# EAGLE design relayboard-v1 (EAGLE 9.6.2)
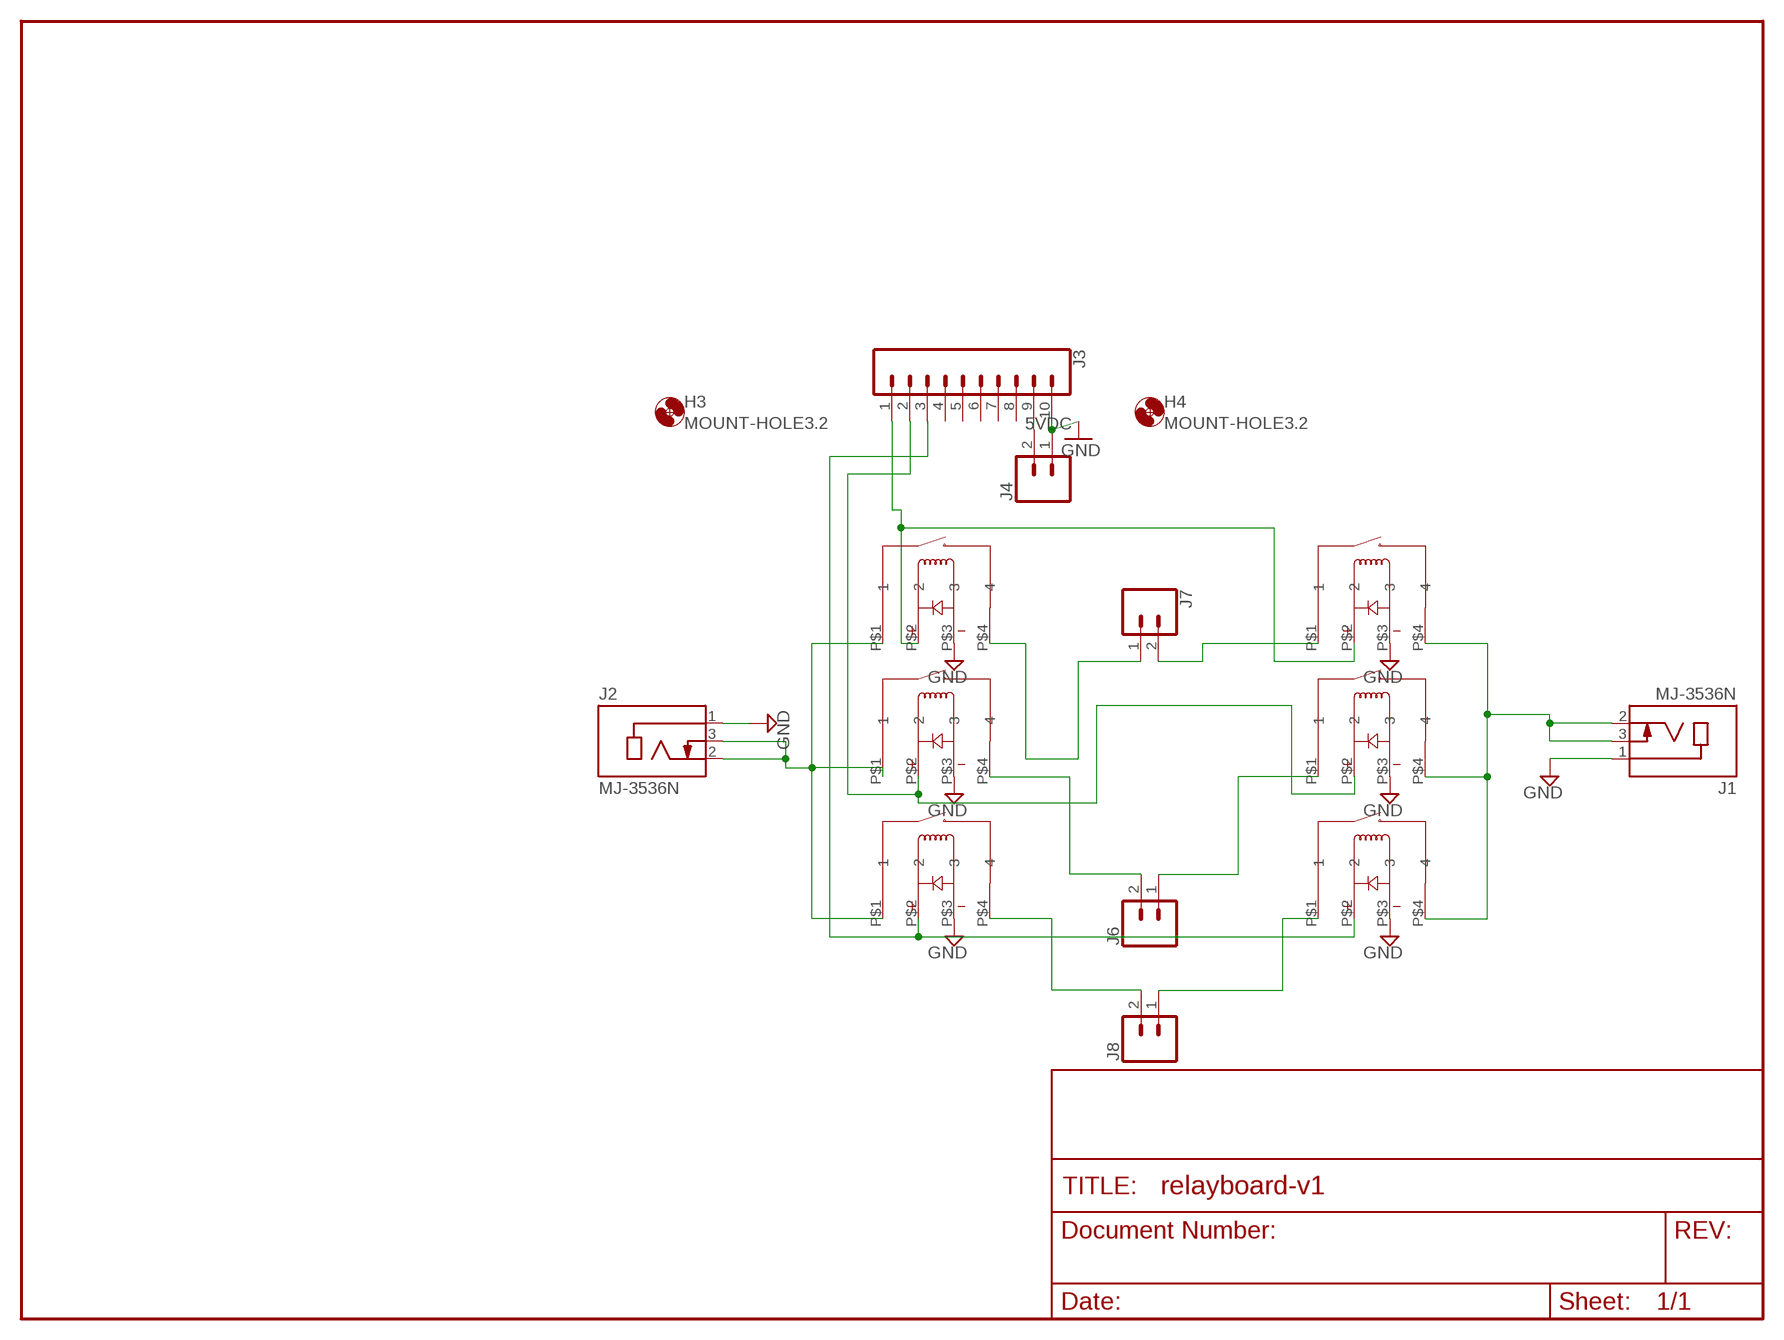
[diagram p0: schematic, sheet 1]

## Parts
H3  MOUNT-HOLE3.2  [3,2]
H4  MOUNT-HOLE3.2  [3,2]
J1  MJ-3536N  [CUI_MJ-3536N]
J2  MJ-3536N  [CUI_MJ-3536N]
J3  CONN_10"  [1X10]
J4  CONN_02  [1X02]
J6  CONN_02  [1X02]
J7  CONN_02  [1X02]
J8  CONN_02  [1X02]
U$3  RELAY-COMUS-3750-1331  [RELAY-COMUS-3570-1331]
U$4  RELAY-COMUS-3750-1331  [RELAY-COMUS-3570-1331]
U$5  RELAY-COMUS-3750-1331  [RELAY-COMUS-3570-1331]
U$6  RELAY-COMUS-3750-1331  [RELAY-COMUS-3570-1331]
U$7  RELAY-COMUS-3750-1331  [RELAY-COMUS-3570-1331]
U$8  RELAY-COMUS-3750-1331  [RELAY-COMUS-3570-1331]

## Nets
5VDC: J3.9 J4.2
GND: J1.1 J2.1 J3.10 J4.1 U$3.P$3 U$4.P$3 U$5.P$3 U$6.P$3 U$7.P$3 U$8.P$3
N$4: J2.2 J2.3 U$3.P$1 U$5.P$1 U$7.P$1
N$5: J8.2 U$7.P$4
N$6: J8.1 U$8.P$1
N$7: J6.2 U$5.P$4
N$8: J6.1 U$6.P$1
N$9: J7.1 U$3.P$4
N$10: J7.2 U$4.P$1
N$11: J3.1 U$3.P$2 U$4.P$2
N$13: J3.3 U$7.P$2 U$8.P$2
N$15: J1.2 J1.3 U$4.P$4 U$6.P$4 U$8.P$4
N$16: J3.2 U$5.P$2 U$6.P$2
Unconnected: J3.4 J3.5 J3.6 J3.7 J3.8

## Library data of the parts
H3 H4 = holes:MOUNT-HOLE: MOUNTING HOLE with drill center marker
J1 J2 = MJ-3536N:MJ-3536N: 2 Conductors 3 Contacts 12V 3.5 mm Right Angle Through Hole Audio Jack Connector; MANUFACTURER: CUI INC; PART_REV: B; STANDARD: MANUFACTURER RECOMMENDATIONS
J3 = SparkFun-Connectors:CONN_10: Multi connection point. Often used as Generic Header-pin footprint for 0.1 inch spaced/style header connections On any of the 0.1 inch spaced packages, you can populate with these: Break Away Headers - Straight <https://www.sparkfun.com/products/116> (PRT-00116) Break Away Male Headers - Right Angle <https://www.sparkfun.com/products/553> (PRT-00553) Female Headers <https://www.sparkfun.com/products/115> (PRT-00115) Break Away Headers - Machine Pin <https://www.sparkfun.com/products/117> (PRT-00117) Break Away Female Headers - Swiss Machine Pin <https://www.sparkfun.com/products/743> (PRT-00743) Arduino Stackable Header - 10 Pin <https://www.sparkfun.com/products/11376> (PRT-11376) For SCREWTERMINALS and SPRING TERMINALS visit here: Screw Terimnals on SparkFun.com <https://www.sparkfun.com/search/results?term=Screw+Terminals> (5mm/3.5mm/2.54mm spacing) This device is also useful as a general connection point to wire up your design to another part of your project. Our various solder wires solder well into these plated through hole pads. Hook-Up Wire - Assortment (Stranded, 22 AWG) <https://www.sparkfun.com/products/11375> (PRT-11375) Hook-Up Wire - Assortment (Solid Core, 22 AWG) <https://www.sparkfun.com/products/11367> (PRT-11367) View the entire wire category on our website here <https://www.sparkfun.com/categories/141> Special notes: Molex polarized connector foot print use with SKU : PRT-08231 with associated crimp pins and housings. 1MM SMD Version SKU: PRT-10208 NOTES ON THE VARIANTS LOCK and LOCK_LONGPADS... This footprint was designed to help hold the alignment of a through-hole component (i.e. 6-pin header) while soldering it into place. You may notice that each hole has been shifted either up or down by 0.005 of an inch from it's more standard position (which is a perfectly straight line). This slight alteration caused the pins (the squares in the middle) to touch the edges of the holes. Because they are alternating, it causes a "brace" to hold the component in place. 0.005 has proven to be the perfect amount of "off-center" position when using our standard breakaway headers. Although looks a little odd when you look at the bare footprint, once you have a header in there, the alteration is very hard to notice. Also,if you push a header all the way into place, it is covered up entirely on the bottom side.; PROD_ID: CONN-11563
J4 J6-J8 = SparkFun-Connectors:CONN_02: Multi connection point. Often used as Generic Header-pin footprint for 0.1 inch spaced/style header connections On any of the 0.1 inch spaced packages, you can populate with these: Break Away Headers - Straight <https://www.sparkfun.com/products/116> (PRT-00116) Break Away Male Headers - Right Angle <https://www.sparkfun.com/products/553> (PRT-00553) Female Headers <https://www.sparkfun.com/products/115> (PRT-00115) Break Away Headers - Machine Pin <https://www.sparkfun.com/products/117> (PRT-00117) Break Away Female Headers - Swiss Machine Pin <https://www.sparkfun.com/products/743> (PRT-00743) For SCREWTERMINALS and SPRING TERMINALS visit here: Screw Terimnals on SparkFun.com <https://www.sparkfun.com/search/results?term=Screw+Terminals> (5mm/3.5mm/2.54mm spacing) This device is also useful as a general connection point to wire up your design to another part of your project. Our various solder wires solder well into these plated through hole pads. Hook-Up Wire - Assortment (Stranded, 22 AWG) <https://www.sparkfun.com/products/11375> (PRT-11375) Hook-Up Wire - Assortment (Solid Core, 22 AWG) <https://www.sparkfun.com/products/11367> (PRT-11367) View the entire wire category on our website here <https://www.sparkfun.com/categories/141> Special notes: Molex polarized connector foot print use with: PRT-08233 with associated crimp pins and housings. 2.54_SCREWTERM for use with PRT-10571. 3.5mm Screw Terminal footprints for PRT-08084 5mm Screw Terminal footprints for use with PRT-08432
U$3-U$8 = spietz-library-2:RELAY-COMUS-3750-1331

## Net classes
1 vcc: width 0.254 mm

## Board
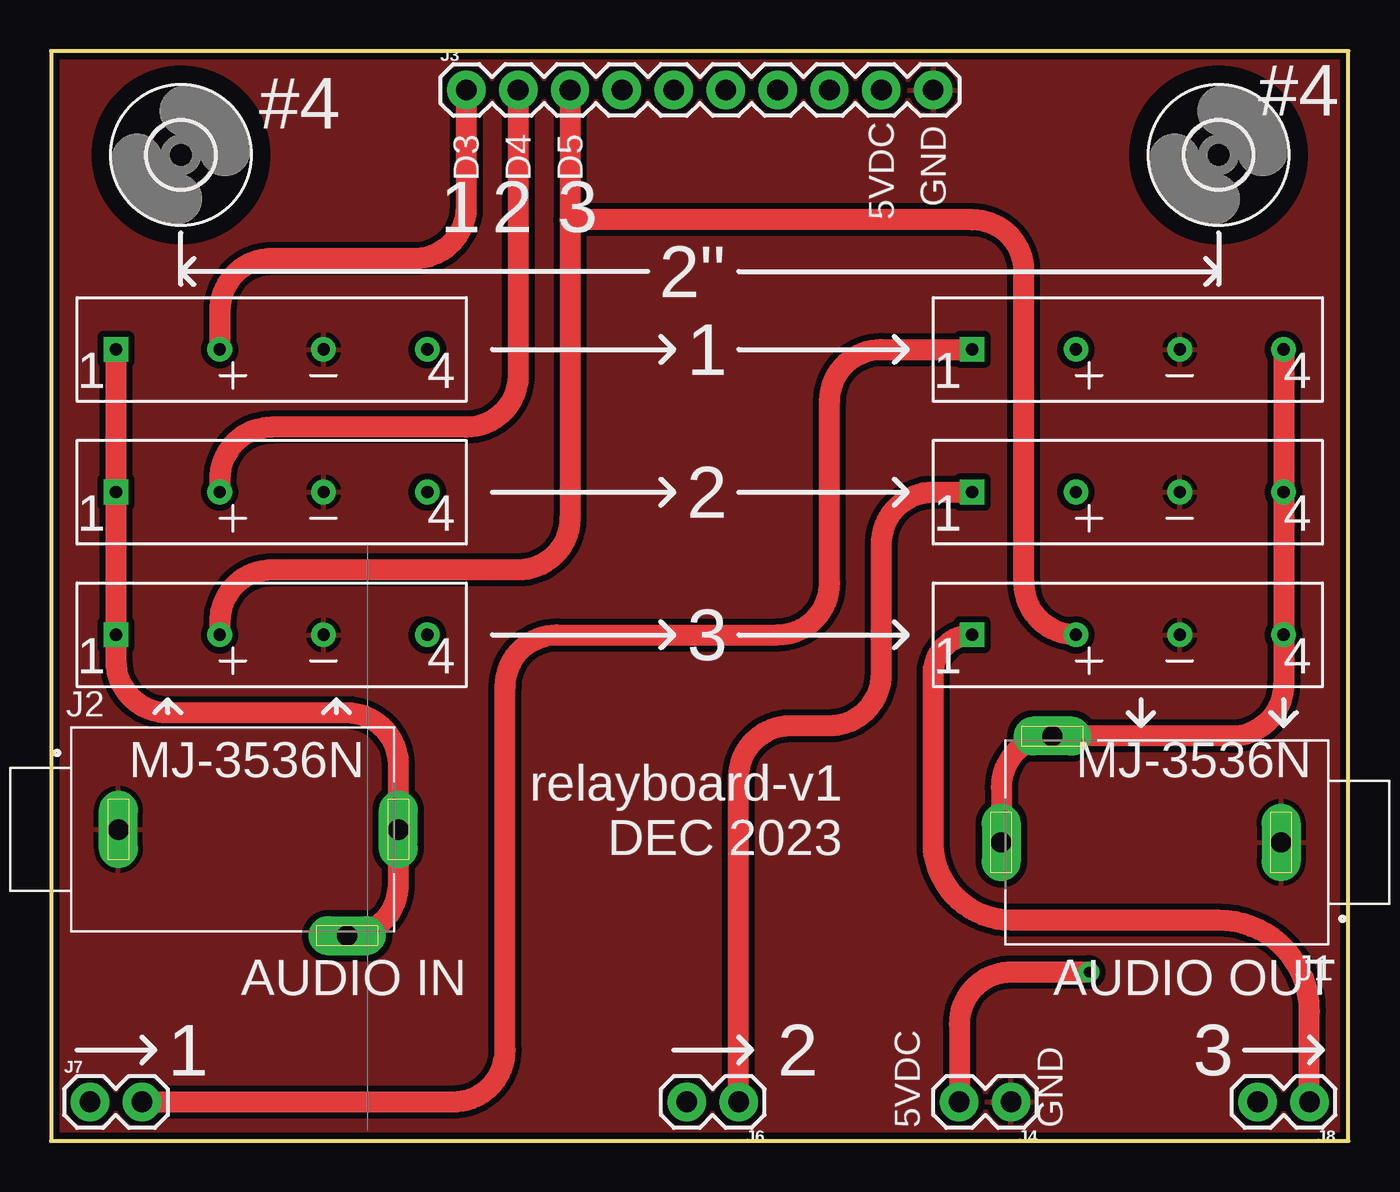
[diagram p1: board, top side]
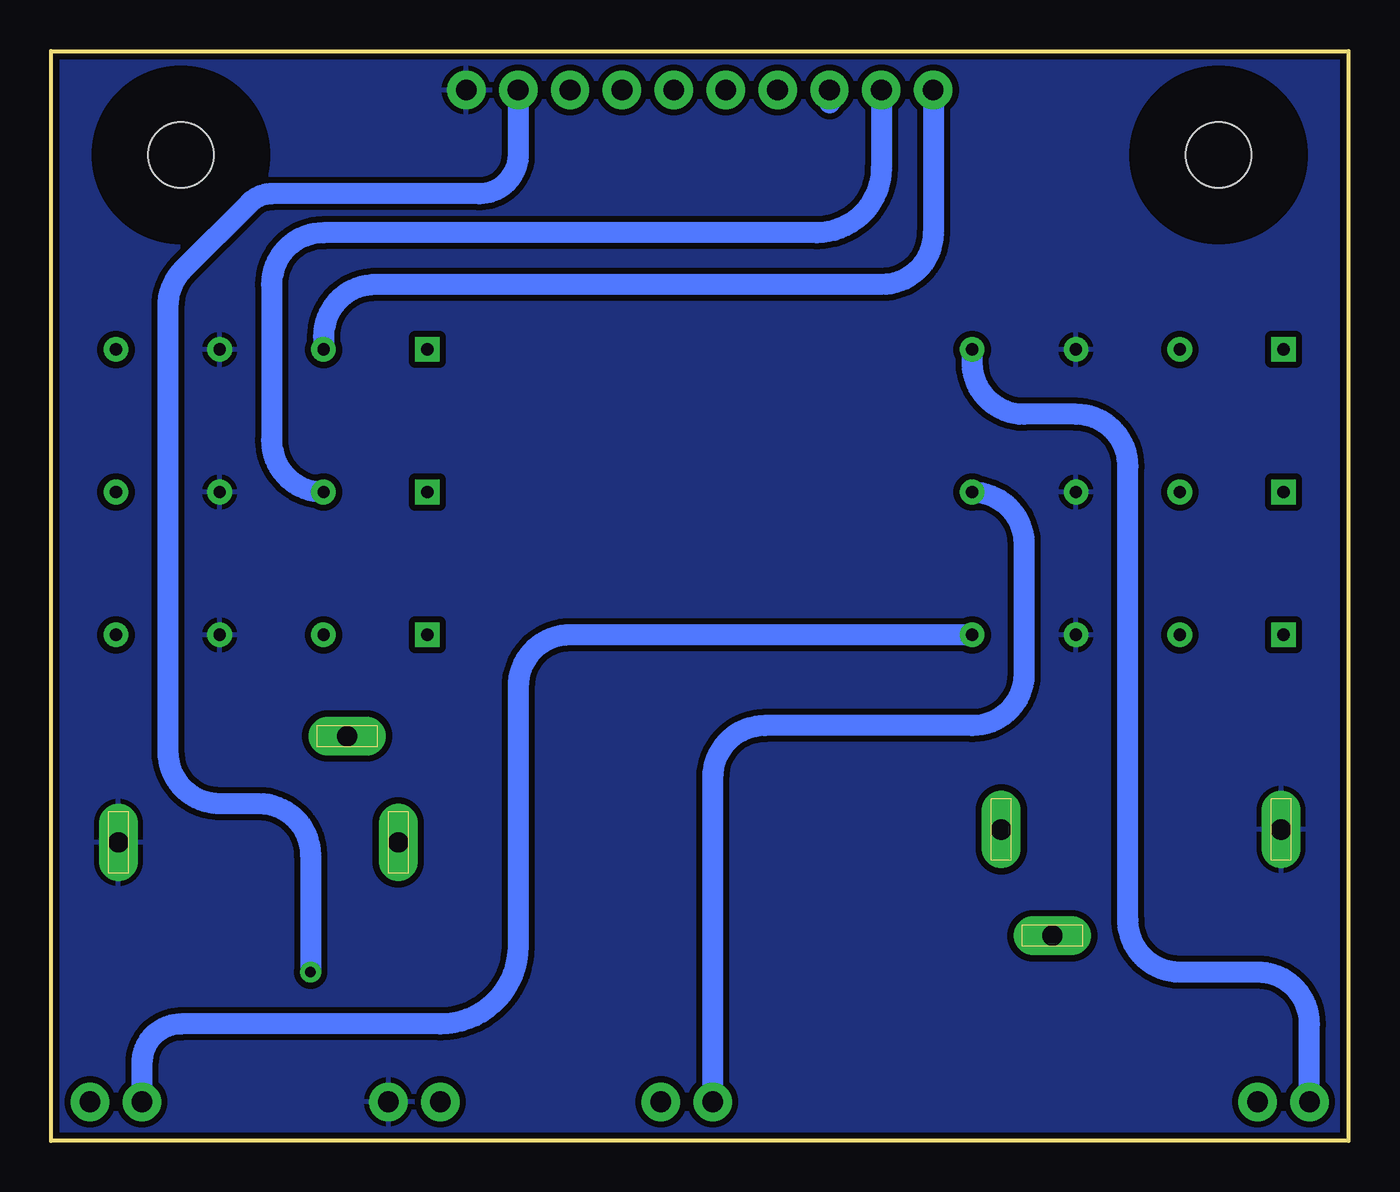
[diagram p2: board, bottom side, seen from below]

Size 63.5 x 53.34 mm. Coordinates in mm from the lower left corner, seen from the top.
Outline: 0,0 63.5,0 63.5,53.34 0,53.34 0,0
Copper layers (1*16): Top 0.035mm / dielectric 1.5mm / Bottom 0.035mm
Design rules "default": minimum track width 8mil, minimum drill 20mil, track to track 8mil, track to pad 8mil, pad to pad 8mil, via to via 8mil, smd to smd 8mil, copper to edge 10mil, drill to drill 8mil, minimum pad ring 12mil, minimum via ring 10mil, stop-mask expansion 4mil, vias tented up to drill 25mil, thermal gap 10mil

### Footprints (pad centres in the part's own frame; a part is rotated, then mirrored left to right if it is on the bottom)
3,2 = hole 3.2: 0,0
CUI_MJ-3536N = drill 1 pad 1.9 long: 1 -5.6,0; 2 8.1,0; 3 5.6,-5.2
1X10 = drill 1.016 pad 1.88: 1 0,0; 2 2.54,0; 3 5.08,0; 4 7.62,0; 5 10.16,0; 6 12.7,0; 7 15.24,0; 8 17.78,0; 9 20.32,0; 10 22.86,0
1X02 = drill 1.016 pad 1.88: 1 0,0; 2 2.54,0
RELAY-COMUS-3570-1331 = drill 0.6 square: P$1 -7.62,0 | drill 0.6: P$2 -2.54,0; P$3 2.54,0; P$4 7.62,0

### Placement (x,y rotation side)
H3  6.35,48.26 0 top
H4  57.15,48.26 0 top
J1  54.61,14.61 180 top
J2  8.89,15.24 0 top
J3  20.32,51.44 0 top
J4  46.99,1.91 180 top
J6  33.66,1.91 180 top
J7  1.91,1.91 0 top
J8  61.59,1.91 180 top
U$3  10.79,38.73 0 top
U$4  52.7,38.73 0 top
U$5  10.79,31.75 0 top
U$6  52.7,31.75 0 top
U$7  10.79,24.77 0 top
U$8  52.7,24.77 0 top

### Tracks (layer width: path | path; a pad name or v marks a point on that pad's centre or on a via)
5VDC  (via drill 0.51)
  Top 1.016: v50.8,8.26 46.99,8.26 arc90 44.45,5.71 J4.2
  Bottom 1.016: J3.9 40.64,48.26 arc90 42.55,46.35 52.7,46.35 arc-45 53.79,45.91 57.04,42.65 arc-45 57.78,40.86 57.78,19.05 arc-90 55.24,16.51 53.34,16.51 arc90 50.8,13.97 v50.8,8.26
GND
  pour Top (isolate 0.305): -1.91,-1.27 -1.91,56.52 64.14,56.52 64.14,-1.27
  pour Bottom (isolate 0.305): -3.81,-2.54 -3.81,56.52 65.41,56.52 65.41,-2.54
N$4
  Top 1.016: U$3.P$1 U$5.P$1 U$7.P$1 3.17,23.5 arc90 5.71,20.95 14.45,20.95 arc-90 16.99,18.41 J2.2 16.99,12.54 arc-90 J2.3
N$5
  Bottom 1.016: U$7.P$4 38.1,24.77 arc-90 40.64,22.23 40.64,9.53 arc90 44.45,5.71 57.15,5.71 arc-90 59.05,3.81 J8.2
N$6
  Top 1.016: J8.1 61.59,6.35 arc90 57.15,10.79 46.99,10.79 arc-90 43.18,14.61 43.18,22.86 arc-90 U$8.P$1
N$7
  Bottom 1.016: U$5.P$4 arc90 15.88,29.21 15.88,22.86 arc90 18.41,20.32 28.57,20.32 arc-90 31.11,17.78 J6.2
N$8
  Top 1.016: J6.1 33.66,17.78 arc-90 36.2,20.32 38.1,20.32 arc90 40.64,22.86 40.64,29.21 arc-90 43.18,31.75 U$6.P$1
N$9
  Bottom 1.016: J7.1 1.91,5.71 arc-90 4.45,8.26 8.26,8.26 arc90 10.79,10.79 10.79,33.02 arc-90 13.34,35.56 15.88,35.56 arc90 18.41,38.1 U$3.P$4
N$10
  Top 1.016: J7.2 19.68,1.91 arc90 22.23,4.45 22.23,22.23 arc-90 24.77,24.77 35.56,24.77 arc90 38.1,27.3 38.1,36.2 arc-90 40.64,38.73 U$4.P$1
N$11
  Top 1.016: J3.1 20.32,45.72 arc-90 17.78,43.18 10.79,43.18 arc90 8.26,40.64 U$3.P$2
  Bottom 1.016: J3.1 20.32,44.45 arc90 22.86,41.91 47.62,41.91 arc-90 50.16,39.37 U$4.P$2
N$13
  Top 1.016: J3.3 25.4,45.09 | 25.4,45.09 25.4,30.48 arc-90 22.86,27.94 10.79,27.94 arc90 8.26,25.4 U$7.P$2 | U$8.P$2 arc-90 47.62,27.3 47.62,42.55 arc90 45.09,45.09 25.4,45.09
  Bottom 1.016: J3.3 25.4,50.8
N$15
  Top 1.016: U$4.P$4 U$6.P$4 U$8.P$4 60.33,22.34 arc-90 57.78,19.8 J1.3 arc90 46.51,17.3 J1.2
N$16
  Top 1.016: J3.2 22.86,37.47 arc-90 20.32,34.92 10.79,34.92 arc90 8.26,32.38 U$5.P$2
  Bottom 1.016: J3.2 22.86,47.62 arc90 26.04,44.45 50.16,44.45 arc-90 52.7,41.91 52.7,34.29 arc-90 U$6.P$2

### Text on the board
tPlace: #4 | #4 | D3 | D4 | D5 | GND | 5VDC | 1 | 2 | 3 | 2" | 1 | 2 | 3 | MJ-3536N | relayboard-v1 / DEC 2023 | MJ-3536N | AUDIO IN | AUDIO OUT | 1 | 2 | 3 | 5VDC | GND
tValues: Tent Vias! | Arduino Wee v1.3